# Altium schematic sheet CAN_IFC.SchDoc
size A3; Organization: Altium Limited; Address1: L3, 12a Rodborough Rd; Address2: Frenchs Forest; Address3: NSW; Address4: Australia 2086
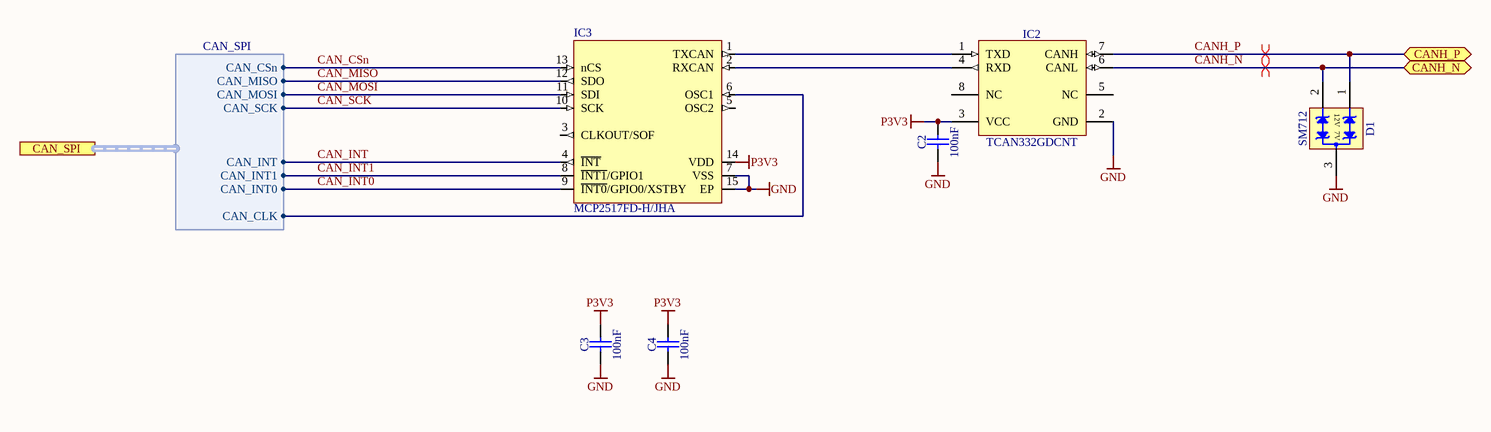
[diagram p0: CAN_IFC.SchDoc]

## Parts
C2  100nF  [CAPC1005X55N]
C3  100nF  [CAPC1005X55N]
C4  100nF  [CAPC1005X55N]
D1  SM712  [SOT95P237X112-3N]
IC2  TCAN332GDCNT  [SOT65P280X145-8N]
IC3  MCP2517FD-H/JHA  [SON65P300X90_HS-15N]

## Ports
CAN_SPI (harness CAN_SPI), CANH_N (bidir), CANH_P (bidir)

## Harnesses
CAN_SPI: CAN_INT1, CAN_INT, CAN_INT0, CAN_SCK, CAN_MOSI, CAN_MISO, CAN_CSn, CAN_CLK

## Nets
GND: C2.1 C3.1 C4.1 D1.3(GND) IC2.2(GND) IC3.7(VSS) IC3.15(EP)
P3V3: C2.2 C3.2 C4.2 IC2.3(VCC) IC3.14(VDD)
CAN_CSn: IC3.13(nCS) ; port CAN_SPI.CAN_CSn
CAN_INT: IC3.4(~{INT}) ; port CAN_SPI.CAN_INT
CAN_INT0: IC3.9(~{INT0}/GPIO0/XSTBY) ; port CAN_SPI.CAN_INT0
CAN_INT1: IC3.8(~{INT1}/GPIO1) ; port CAN_SPI.CAN_INT1
CAN_MISO: IC3.12(SDO) ; port CAN_SPI.CAN_MISO
CAN_MOSI: IC3.11(SDI) ; port CAN_SPI.CAN_MOSI
CAN_SCK: IC3.10(SCK) ; port CAN_SPI.CAN_SCK
CANH_N: D1.2(I/O2) IC2.6(CANL) ; port CANH_N
CANH_P: D1.1(I/O1) IC2.7(CANH) ; port CANH_P
NetIC2_1: IC2.1(TXD) IC3.1(TXCAN)
NetIC2_4: IC2.4(RXD) IC3.2(RXCAN)
NetIC3_6: IC3.6(OSC1) ; port CAN_SPI.CAN_CLK

Not connected (* = marked no-connect by the designer): IC2 5(NC) 8(NC); IC3 3(CLKOUT/SOF) 5(OSC2)

## Layout directives
differential pair: CANH_N, CANH_P

## Notes on the sheet
- Title
- Size:
- Date:
- A3
- Number:
- Time:
- Revision:
- Sheet
- of
- File:
- (in symbol SM712) 12V; 7V

## Library data of the parts
C2-C4 = CC0402_100NF_16V_10%_X5R: Non-polarised capacitor; Part Description: SMD Multilayer Chip Ceramic Capacitor; Manufacturer: GENERIC; Manufacturer1 Part Number: GRM155R61C104KA88D; Voltage: 16V; TC: X5R; Tolerance: ±10%; Part Number: CC0402_100NF_16V_10%_X5R; Component Kind: Standard; Component Type: Standard; Pin Count: 2; Value: 100nF; Status: None; Manufacturer Part Number: CC0402_100NF_16V_10%_X5R; Case: 0402; Mounted: Yes; Socket: No; SMD: Yes; Sense: No; Manufacturer1 Example: MURATA; Manufacturer1 ComponentHeight: 0.55mm; HelpURL: \\cern.ch\dfs\Applications\Altium\Datasheets\CC0402_X5R_MURATA_GRM.pdf; Author: CERN DEM JLC; CreateDate: 10.12.2013; LatestRevisionDate: 10.12.2013
D1 = SM712: Asymmetrical TVS Diode for Extended Common-Mode RS-485; Manufacturer: SEMTECH; Voltage: 12V/-7V; Power: 400W; PressFit: No; Bonding: No; Part Number: SM712; Component Kind: Standard; Component Type: Standard; Device: SM712; PackageDescription: SOT, 0.95mm, pitch; 3 pin,1.30mm W X 2.92mm L X 1.12mm H body, IPC Medium Density; Status: Obsolete; Part Description: Asymmetrical TVS Diode for Extended Common-Mode RS-485; Manufacturer Part Number: SM712; Pin Count: 3; Case: SOT-23; Mounted: Yes; Socket: No; SMD: Yes; Sense: No; ComponentHeight: 1.12mm; HelpURL: \\cern.ch\dfs\Applications\Altium\Datasheets\SM712.pdf; Author: CERN DEM JLC; CreateDate: 23/04/2012; LatestRevisionDate: 23/04/2012
IC2 = TCAN332GDCNT: 3.3V CAN Transceivers with CAN FD (Flexible Data Rate); Manufacturer: TEXAS INSTRUMENTS; PressFit: No; Bonding: No; Part Number: TCAN332GDCNT; Component Kind: Standard; Component Type: Standard; Device: TCAN332GDCNT; PackageDescription: SOT, 0.65mm pitch; 8 pin, 1.625mm W X 2.90mm L X 1.45mm H body, IPC Medium Density; Part Description: 3.3V CAN Transceivers with CAN FD (Flexible Data Rate); Manufacturer Part Number: TCAN332GDCNT; Pin Count: 8; Case: SOT23-8; Mounted: Yes; Socket: No; SMD: Yes; Sense: No; ComponentHeight: 1.45mm; Author: CERN DEM JLC; HelpURL: \\cern.ch\dfs\Applications\Altium\Datasheets\TCAN332GDCNT.pdf; CreateDate: 22/08/2017; LatestRevisionDate: 22/08/2017
IC3 = IFC_MCP2517: External CAN FD Controller with SPI Interface; Manufacturer: Microchip; Case: VDFN14; Component Type: Standard; Device: MCP2517FD-H/JHA; Manufacturer Part Number: MCP2517FD-H/JHA; Mounted: Yes; PackageDescription: DFN, 14-Leads, Body 4.50x3.00mm, Pitch 0.65mm, Thermal Pad 4.20x1.60mm, IPC Medium Density; Part Description: External CAN FD Controller with SPI Interface; Part Number: MCP2517FD-H/JHA; Pin Count: 14; SMD: Yes